# EAGLE design R016 - Slice of Radio v1.1 (EAGLE 6.1)
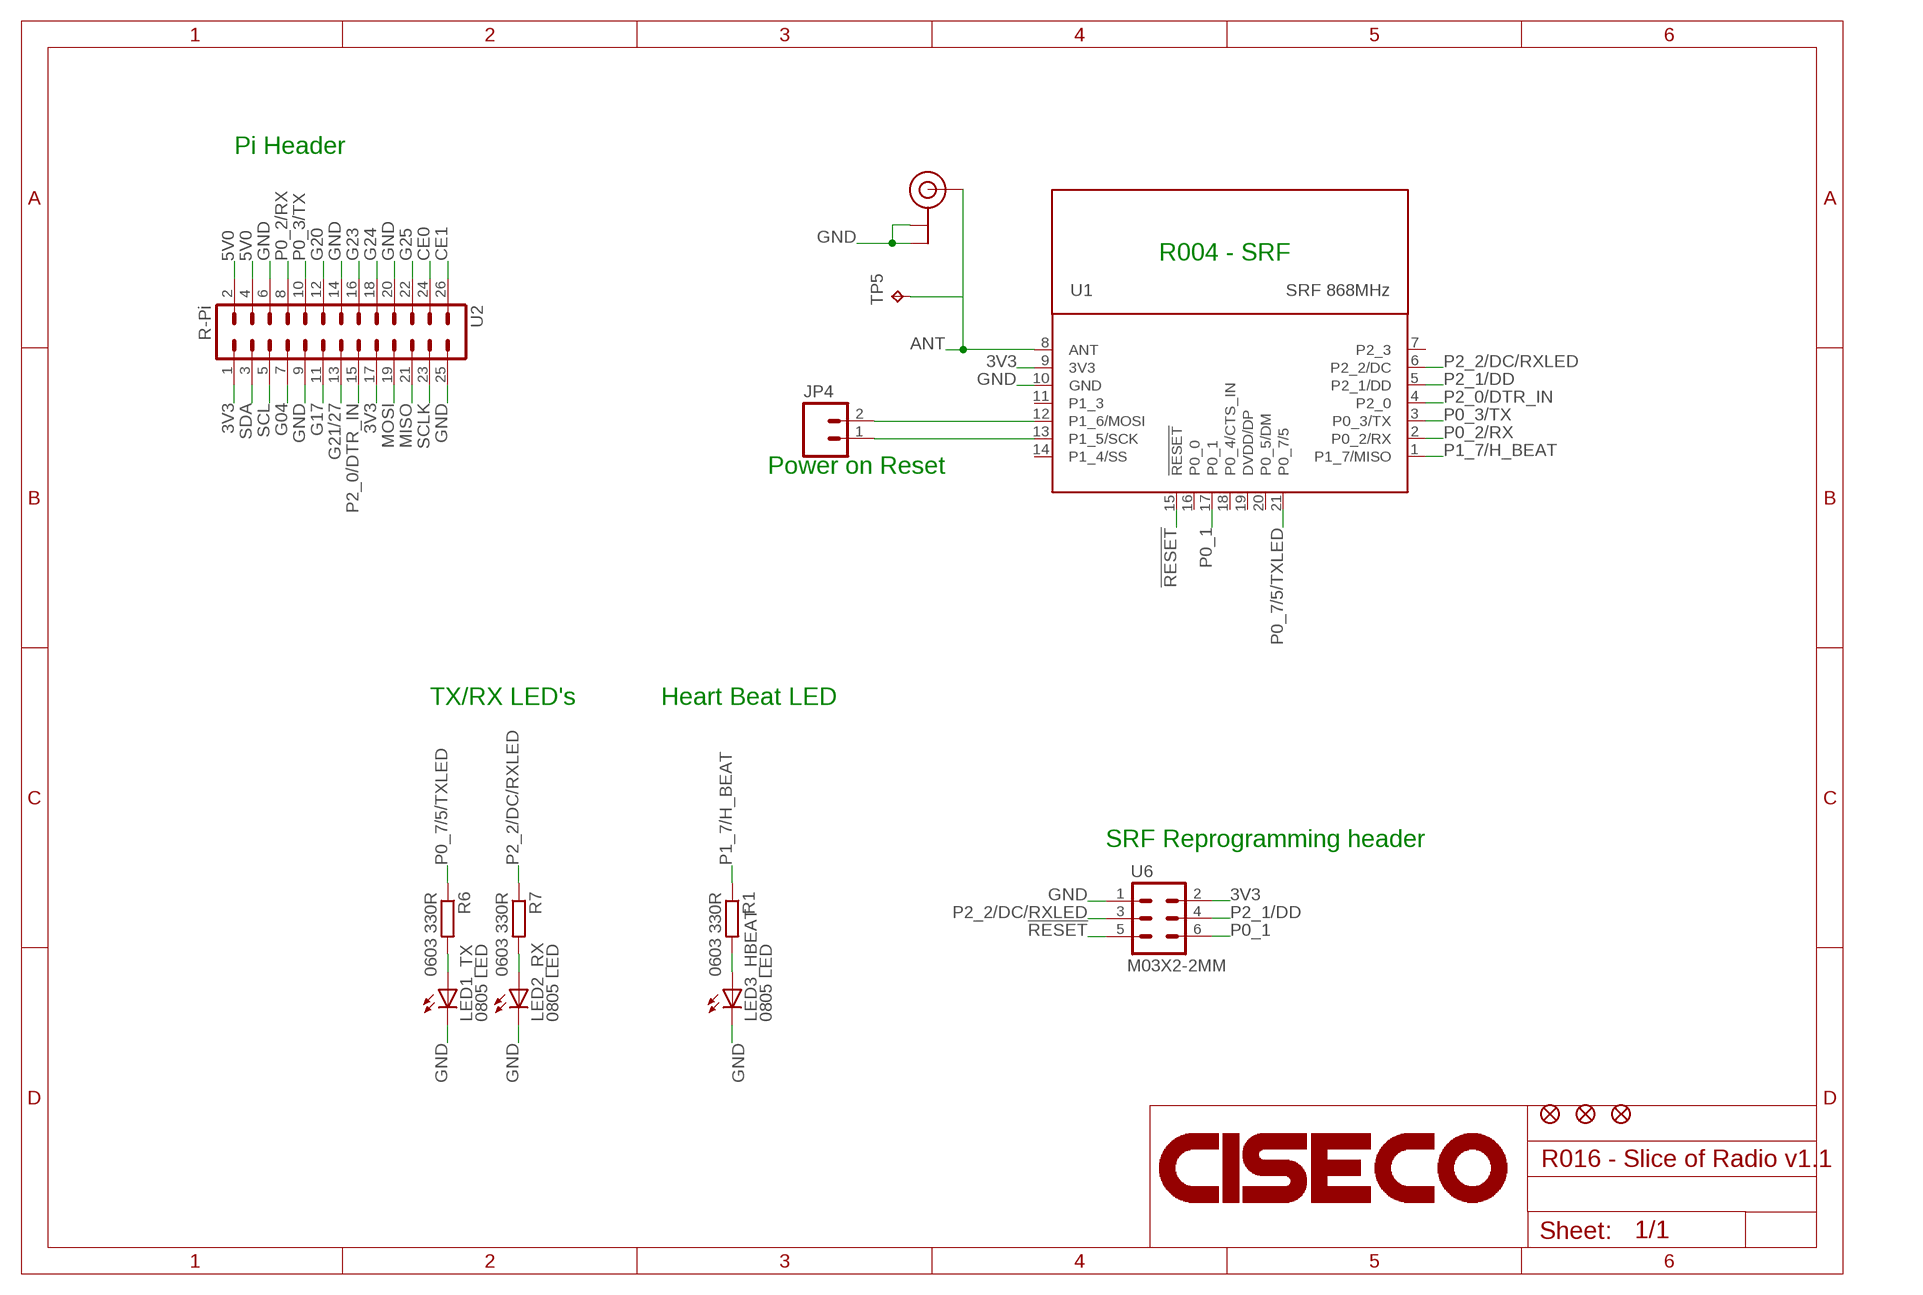
[diagram p0: schematic, sheet 1]

## Parts
JP1  FIDUCIAL1X2.5-STOP  [FIDUCIAL-1X2.5-STOP]
JP2  FIDUCIAL1X2.5-STOP  [FIDUCIAL-1X2.5-STOP]
JP3  FIDUCIAL1X2.5-STOP  [FIDUCIAL-1X2.5-STOP]
JP4  M02PTH  [1X02]
LED1_TX  0805 LED  LED0805-CORRECT  [LED-0805-CORRECT]
LED2_RX  0805 LED  LED0805-CORRECT  [LED-0805-CORRECT]
LED3_HBEAT  0805 LED  LED0805-CORRECT  [LED-0805-CORRECT]
LOGO1  CISECOLOGO-2MM  [CISECO-2MM]
R1  0603 330R  R-EU_0603K-SMALL  [C0603K-SMALL]
R6  0603 330R  R-EU_0603K-SMALL  [C0603K-SMALL]
R7  0603 330R  R-EU_0603K-SMALL  [C0603K-SMALL]
TP5  TPPAD1-13  [P1-13]
U1  SRF 868MHz  SRF-LANDING-1.2  [SRF-LANDING-1.2]
U2  R-Pi  EVE-REFRENCE-LOCK  [EVE-BOARD-REF-LOCK]
U6  M03X2-2MM  [2X3_2MM]
U11  U.FL 868  U.FL  [U.FL]

## Nets
3V3: U1.9(3V3) U2.1 U2.17 U6.2
5V0: U2.2 U2.4
!RESET: U1.15(!RESET) U6.5
ANT [ANT]: TP5.TP U1.8(ANT) U11.P$3(SIGNAL)
CE0: U2.24
CE1: U2.26
G04: U2.7
G17: U2.11
G20: U2.12
G21/27: U2.13
G23: U2.16
G24: U2.18
G25: U2.22
GND: LED1_TX.C LED2_RX.C LED3_HBEAT.C U1.10(GND) U2.6 U2.9 U2.14 U2.20 U2.25 U6.1 U11.P$1(GND) U11.P$2(GND)
MISO: U2.21
MOSI: U2.19
N$1: LED3_HBEAT.A R1.2
N$2: JP4.1 U1.13(P1_5/SCK)
N$3: JP4.2 U1.12(P1_6/MOSI)
N$35: LED2_RX.A R7.2
N$36: LED1_TX.A R6.2
P0_1: U1.17(P0_1) U6.6
P0_2/RX: U1.2(P0_2/RX) U2.8
P0_3/TX: U1.3(P0_3/TX) U2.10
P0_7/5/TXLED: R6.1 U1.21(P0_7/5)
P1_7/H_BEAT: R1.1 U1.1(P1_7/MISO)
P2_0/DTR_IN: U1.4(P2_0) U2.15
P2_1/DD: U1.5(P2_1/DD) U6.4
P2_2/DC/RXLED: R7.1 U1.6(P2_2/DC) U6.3
SCL: U2.5
SCLK: U2.23
SDA: U2.3
Unconnected: U1.7(P2_3) U1.11(P1_3) U1.14(P1_4/SS) U1.16(P0_0) U1.18(P0_4/CTS_IN) U1.19(DVDD/DP) U1.20(P0_5/DM)

## Notes on the sheet
- Pi Header
- R004 - SRF
- Power on Reset
- TX/RX LED's | Heart Beat LED
- SRF Reprogramming header

## Library data of the parts
JP1-JP3 = CISECO eaglecad designs:FIDUCIAL: Fiducial Alignment Points Various fiducial points for machine vision alignment.
JP4 = CISECO eaglecad designs:M02: Header 2 Standard 2-pin 0.1" header. Use with straight break away headers (SKU : PRT-00116), right angle break away headers (PRT-00553), swiss pins (PRT-00743), machine pins (PRT-00117), and female headers (PRT-00115). Molex polarized connector foot print use with SKU : PRT-08233 with associated crimp pins and housings.
LED1_TX LED2_RX LED3_HBEAT = CISECO eaglecad designs:LED: LEDs Standard schematic elements and footprints for 5mm, 3mm, 1206, and 0603 sized LEDs. 5mm - Spark Fun Electronics SKU : COM-00529 (and others)
LOGO1 = Ciseco Footprints:CISECOLOGO
R1 R6 R7 = CISECO eaglecad designs:R-EU_: RESISTOR, European symbol
TP5 = testpad:TP: Test pad
U1 = Ciseco Footprints:SRF: SRF Wireless UART Serial Data Module. www.ciseco.co.uk
U2 = CISECO eaglecad designs:EVE
U6 = CISECO eaglecad designs:M03X2
U11 = CISECO eaglecad designs:U.FL

## Net classes
1 ANT: width 1.27 mm, drill 0.3 mm, clearance 0.381 mm

## Board
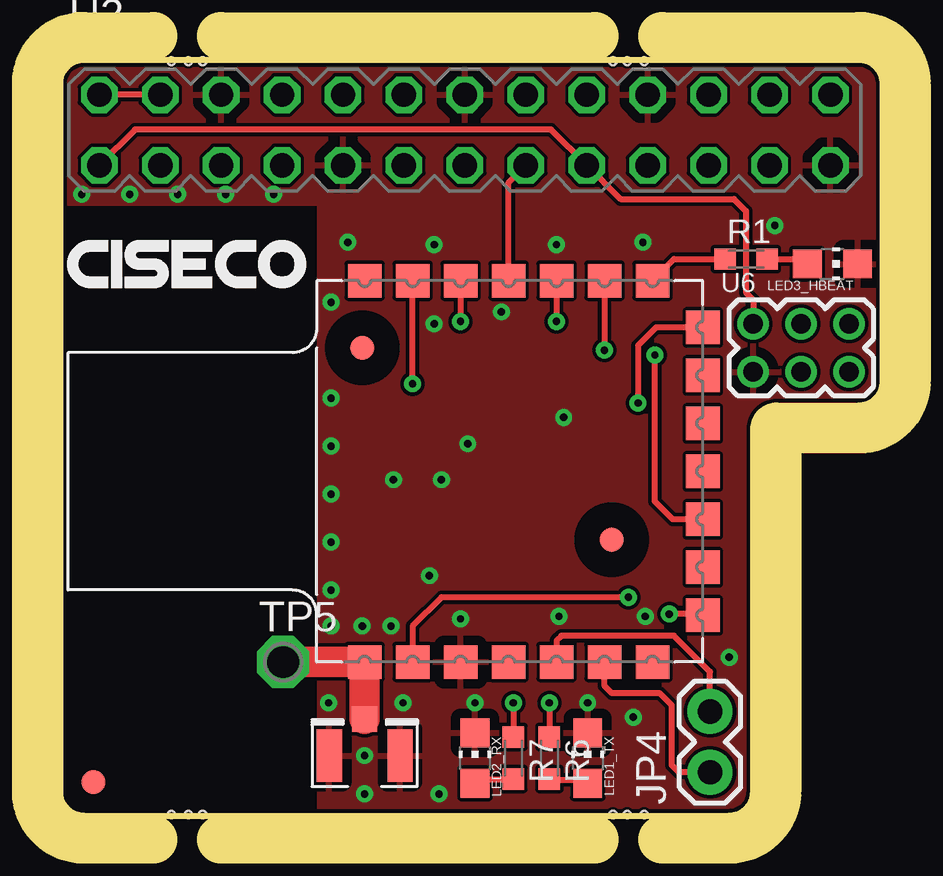
[diagram p1: board, top side]
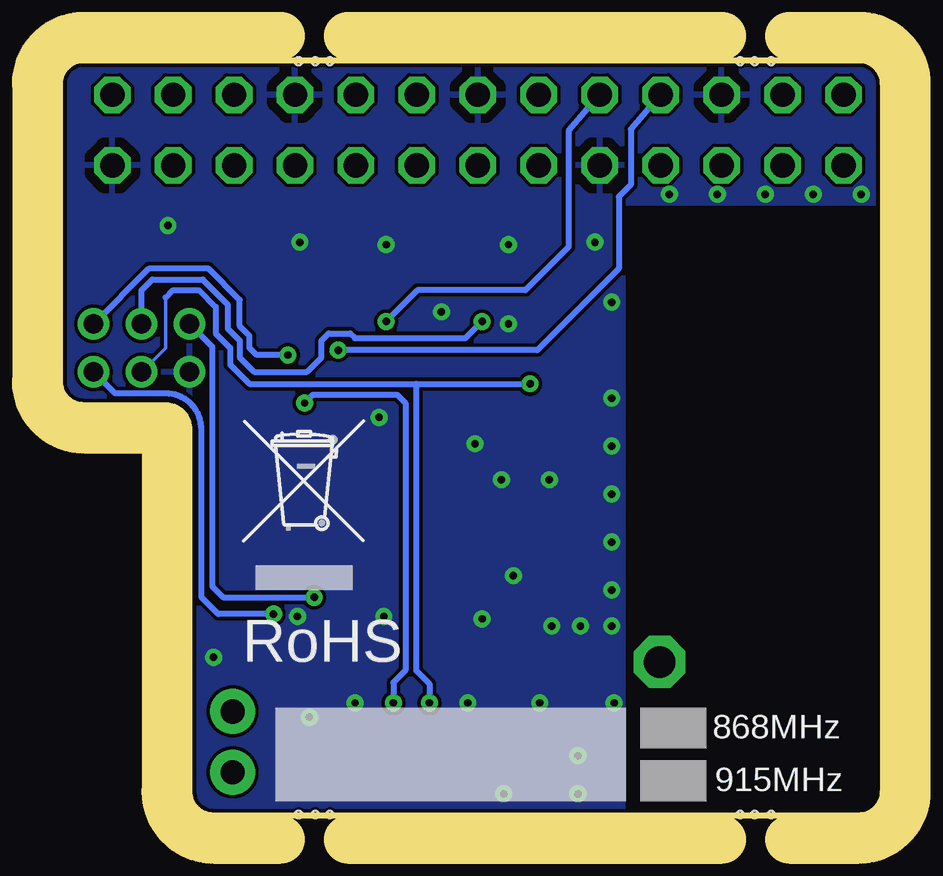
[diagram p2: board, bottom side, seen from below]

Size 34.3 x 31.5 mm. Coordinates in mm from the lower left corner, seen from the top.
Outline: 33.3,31.5 1,31.5 arc90 0,30.5 0,1 arc90 1,0 27.9,0 arc90 28.9,1 28.9,16.1 arc-90 29.9,17.1 33.3,17.1 arc90 34.3,18.1 34.3,30.5 arc90 33.3,31.5
Copper layers (1*16): Top 0.035mm / dielectric 1mm / Bottom 0.035mm
Design rules: minimum track width 0.15mm, minimum drill 0.3mm, track to track 0.15mm, track to pad 0.15mm, pad to pad 0.15mm, via to via 0.15mm, smd to smd 0mil, copper to edge 0.15mm, drill to drill 0.15mm, minimum pad ring 10mil, minimum via ring 8mil, stop-mask expansion 4mil, vias tented up to drill 23mil, thermal gap 16mil
Holes 0.3 mm at 5.95,0.05 5.35,0.05 4.65,0.05 24.35,0.05 23.65,0.05 23.05,0.05 4.65,31.45 5.35,31.45 5.95,31.45 23.05,31.45 23.65,31.45 24.35,31.45
tRestrict: area 0.3,0 to 10.7,9.4; area 0.3,19.3 to 10.7,25.4
bRestrict: area 0.3,0 to 10.7,9.4; area 0.3,19.3 to 10.7,25.4
Milling: 15 lines

### Footprints (pad centres in the part's own frame; a part is rotated, then mirrored left to right if it is on the bottom)
FIDUCIAL-1X2.5-STOP = smd 1 x 1: 1 0,0
1X02 = drill 1.016 pad 1.88: 1 0,0; 2 2.54,0
LED-0805-CORRECT = smd 1.2 x 1.2: A 1.05,0; C -1.05,0
C0603K-SMALL = smd 0.889 x 0.889: 1 -0.875,0; 2 0.875,0
P1-13 = drill 1.321 pad 2.159 octagon: TP 0,0
SRF-LANDING-1.2 = smd 1.4 x 1.4: 1 15.9,2; 2 15.9,4; 3 15.9,6; 4 15.9,8; 5 15.9,10; 6 15.9,12; 7 15.9,14; 8 0,14; 9 0,12; 10 0,10; 11 0,8; 12 0,6; 13 0,4; 14 0,2; 15 1.95,-0.1; 16 3.95,-0.1; 17 5.95,-0.1; 18 7.95,-0.1; 19 9.95,-0.1; 20 11.95,-0.1; 21 13.95,-0.1
EVE-BOARD-REF-LOCK = drill 1.016 octagon: 1 2.44,50.11; 2 2.44,53.05; 3 4.98,50.11; 4 4.98,53.05; 5 7.52,50.11; 6 7.52,53.05; 7 10.06,50.11; 8 10.06,53.05; 9 12.6,50.11; 10 12.6,53.05; 11 15.14,50.11; 12 15.14,53.05; 13 17.68,50.11; 14 17.68,53.05; 15 20.22,50.11; 16 20.22,53.05; 17 22.76,50.11; 18 22.76,53.05; 19 25.3,50.11; 20 25.3,53.05; 21 27.84,50.11; 22 27.84,53.05; 23 30.38,50.11; 24 30.38,53.05; 25 32.92,50.11; 26 32.92,53.05
2X3_2MM = drill 0.8: 1 -2,-1; 2 -2,1; 3 0,-1; 4 0,1; 5 2,-1; 6 2,1
U.FL = smd 2.2 x 1.05: P$1 0,1.475; P$2 0,-1.475 | smd 1.05 x 1.05: P$3 1.525,0

### Placement (x,y rotation side)
JP1  23,11.5 0 top
JP2  1.4,1.4 0 top
JP3  12.6,19.5 0 top
JP4  27.1,1.8 90 top
LED1_TX  22,2.4 270 top
LED2_RX  17.3,2.4 270 top
LED3_HBEAT  32.2,23 180 top
LOGO1  0.3,22 0 top
R1  28.6,23.2 0 top
R6  20.4,2.4 270 top
R7  18.9,2.4 270 top
TP5  9.3,6.4 0 top
U1  26.7,6.4 90 top
U2  -0.8,-23 0 top
U6  30.9,19.5 0 top
U11  12.7,2.5 90 top
U$4  [WEEE-LOGO]  26.7,9.4 0 bottom
U$5  [PIBOW]  -0.8,-8 0 top  (outside the outline)

### Tracks (layer width: path | path; a pad name or v marks a point on that pad's centre or on a via)
3V3  (via drill 0.3)
  Top 0.254: v23.7,9.1 15.9,9.1 14.7,7.9 U1.9 | U2.1 3.13,28.6 20.47,28.6 U2.17 23.37,25.7 28.1,25.7 28.6,25.2 28.6,21.8 28.9,21.5 U6.2
  Bottom 0.254: v23.7,9.1 27.5,9.1 27.95,9.55 27.95,19.55 U6.2
5V0
  Top 0.254: U2.4 U2.2
!RESET  (via drill 0.3)
  Top 0.254: 26.85,8.4 U1.15 26.75,8.4 v25.4,8.4
  Bottom 0.254: v25.4,8.4 27.7,8.4 28.4,9.1 28.4,16.1 arc-90 29.9,17.6 32,17.6 U6.5
ANT
  Top 1.27: U11.P$3 U1.8 TP5.TP
GND  (via drill 0.3)
  other vias: 11.3,7.9 27.9,6.6 20.7,23.8 21,16.6 15.4,10 11.3,9.4 17,15.5 15.6,23.8 15.9,14 13.9,14 13.8,7.9 17.3,4.7 22,4.7 11.2,4.7 12.7,2.5 14.3,4.7 12.6,7.9 11.3,11.4 11.3,13.4 11.3,15.4 11.3,17.4 11.3,21.4 24.4,8.3 20.8,8.3 16.7,8.2 23.9,4.1 15.8,0.9 12.7,0.9 15.6,20.5 18.4,21 0.9,25.9 2.9,25.9 4.9,25.9 6.9,25.9 8.9,25.9 29.8,24.6 24.3,23.9 12,23.9
  pour Top: 33.3,31.5 1,31.5 arc90 0,30.5 0,1 arc90 1,0 27.9,0 arc90 28.9,1 28.9,16.1 arc-90 29.9,17.1 33.3,17.1 arc90 34.3,18.1 34.3,30.5 arc90
  pour Bottom: 33.3,31.5 1,31.5 arc90 0,30.5 0,1 arc90 1,0 27.9,0 arc90 28.9,1 28.9,16.1 arc-90 29.9,17.1 33.3,17.1 arc90 34.3,18.1 34.3,30.5 arc90
N$1
  Top 0.254: R1.2 31.15,23.2 LED3_HBEAT.A
N$2
  Top 0.254: JP4.1 25.8,1.8 25.5,2.1 25.5,4.6 25,5.1 23,5.1 22.7,5.4 U1.13
N$3
  Top 0.254: JP4.2 27.1,6 25.6,7.5 20.9,7.5 20.7,7.3 U1.12
N$35
  Top 0.254: R7.2 18.9,1.5 17.3,1.5 LED2_RX.A
N$36
  Top 0.254: R6.2 20.4,1.5 22,1.5 LED1_TX.A
P0_1  (via drill 0.3)
  Top 0.254: U1.17 25.55,12.35 24.8,13.1 v24.8,19.2
  Bottom 0.254: v24.8,19.2 26.1,19.2 26.4,19.5 26.4,20 26.8,20.4 26.8,21.5 28.1,22.8 30.6,22.8 U6.6
P0_2/RX  (via drill 0.3)
  Top 0.254: U1.2 v22.7,19.4
  Bottom 0.254: U2.8 10.5,28.61 10.5,26.3 11,25.8 11,22.8 14.4,19.4 v22.7,19.4
P0_3/TX  (via drill 0.3)
  Top 0.254: U1.3 v20.7,20.6
  Bottom 0.254: U2.10 13.1,28.55 13.1,23.7 14.9,21.9 19.4,21.9 v20.7,20.6
P0_7/5/TXLED  (via drill 0.3)
  Top 0.254: U1.21 24.85,20.35 24.1,19.6 v24.1,17.2 | v20.4,4.7 R6.1
  Bottom 0.254: v24.1,17.2 23.75,17.55 20.25,17.55 19.9,17.2 19.9,6.05 20.4,5.55 v20.4,4.7
P1_7/H_BEAT
  Top 0.254: R1.1 25.6,23.2 U1.1
P2_0/DTR_IN
  Top 0.254: U1.4 18.7,26.39 U2.15
P2_1/DD  (via drill 0.3)
  Top 0.254: U1.5 v16.7,20.6
  Bottom 0.254: U6.4 30.9,21.9 30.45,22.35 28.35,22.35 27.3,21.3 27.3,20.3 26.8,19.8 26.8,19.1 26.2,18.5 24,18.5 23.4,19.1 23.4,19.8 23.1,20.1 22.2,20.1 22,19.9 17.4,19.9 v16.7,20.6
P2_2/DC/RXLED  (via drill 0.3)
  Top 0.254: v14.7,18 U1.6 | v18.9,4.7 R7.1
  Bottom 0.15: 29.9,21.6 29.9,19.5 U6.3
  Bottom 0.254: 19.45,18 26.4,18 27.2,18.8 27.2,19.5 27.8,20.1 27.8,21.2 28.5,21.9 29.6,21.9 29.9,21.6 | 19.45,18 v14.7,18 | 19.45,18 19.45,6.05 18.9,5.5 v18.9,4.7

### Text on the board
bPlace: RoHS | 868MHz | 915MHz
Document: Heart Beat | c | 2013 | V1.1 | R016 | Slice | of Radio | TX | RX | Rst